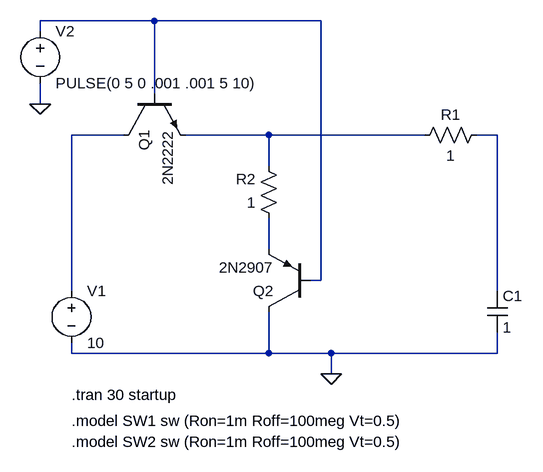
[diagram p0: schematic part2-1.asc]
part2-1.asc, the LTspice schematic file:
Version 4
SHEET 1 880 680
WIRE 144 -112 -32 -112
WIRE 400 -112 144 -112
WIRE -32 -96 -32 -112
WIRE 144 0 144 -112
WIRE -32 16 -32 -16
WIRE 96 64 16 64
WIRE 320 64 192 64
WIRE 560 64 320 64
WIRE 672 64 640 64
WIRE 320 112 320 64
WIRE 320 240 320 192
WIRE 400 288 400 -112
WIRE 400 288 384 288
WIRE 16 304 16 64
WIRE 672 304 672 64
WIRE 16 400 16 384
WIRE 320 400 320 336
WIRE 320 400 16 400
WIRE 416 400 320 400
WIRE 672 400 672 368
WIRE 672 400 416 400
WIRE 416 432 416 400
FLAG 416 432 0
FLAG -32 16 0
SYMBOL voltage 16 288 R0
SYMATTR InstName V1
SYMATTR Value 10
SYMBOL res 656 48 R90
WINDOW 0 0 56 VBottom 2
WINDOW 3 32 56 VTop 2
SYMATTR InstName R1
SYMATTR Value 1
SYMBOL cap 656 304 R0
SYMATTR InstName C1
SYMATTR Value 1
SYMBOL voltage -32 -112 R0
SYMATTR InstName V2
SYMATTR Value PULSE(0 5 0 .001 .001 5 10)
SYMBOL npn 96 0 M90
SYMATTR InstName Q1
SYMATTR Value 2N2222
SYMBOL pnp 384 336 R180
SYMATTR InstName Q2
SYMATTR Value 2N2907
SYMBOL res 336 208 R180
WINDOW 0 36 76 Left 2
WINDOW 3 36 40 Left 2
SYMATTR InstName R2
SYMATTR Value 1
TEXT 16 464 Left 2 !.tran 30 startup
TEXT 16 504 Left 2 !.model SW1 sw (Ron=1m Roff=100meg Vt=0.5)
TEXT 16 536 Left 2 !.model SW2 sw (Ron=1m Roff=100meg Vt=0.5)

The netlist it stands for:
* part2-1.asc
V1 N002 0 10
R1 N004 N003 1
C1 N004 0 1
V2 N001 0 PULSE(0 5 0 .001 .001 5 10)
Q1 N002 N001 N003 0 2N2222
Q2 0 N001 N005 0 2N2907
R2 N005 N003 1
.model NPN NPN
.model PNP PNP
.lib standard.bjt
.tran 30 startup
.model SW1 sw (Ron=1m Roff=100meg Vt=0.5)
.model SW2 sw (Ron=1m Roff=100meg Vt=0.5)
.backanno
.end